# EAGLE design Control v1.0 (EAGLE 9.1.3)
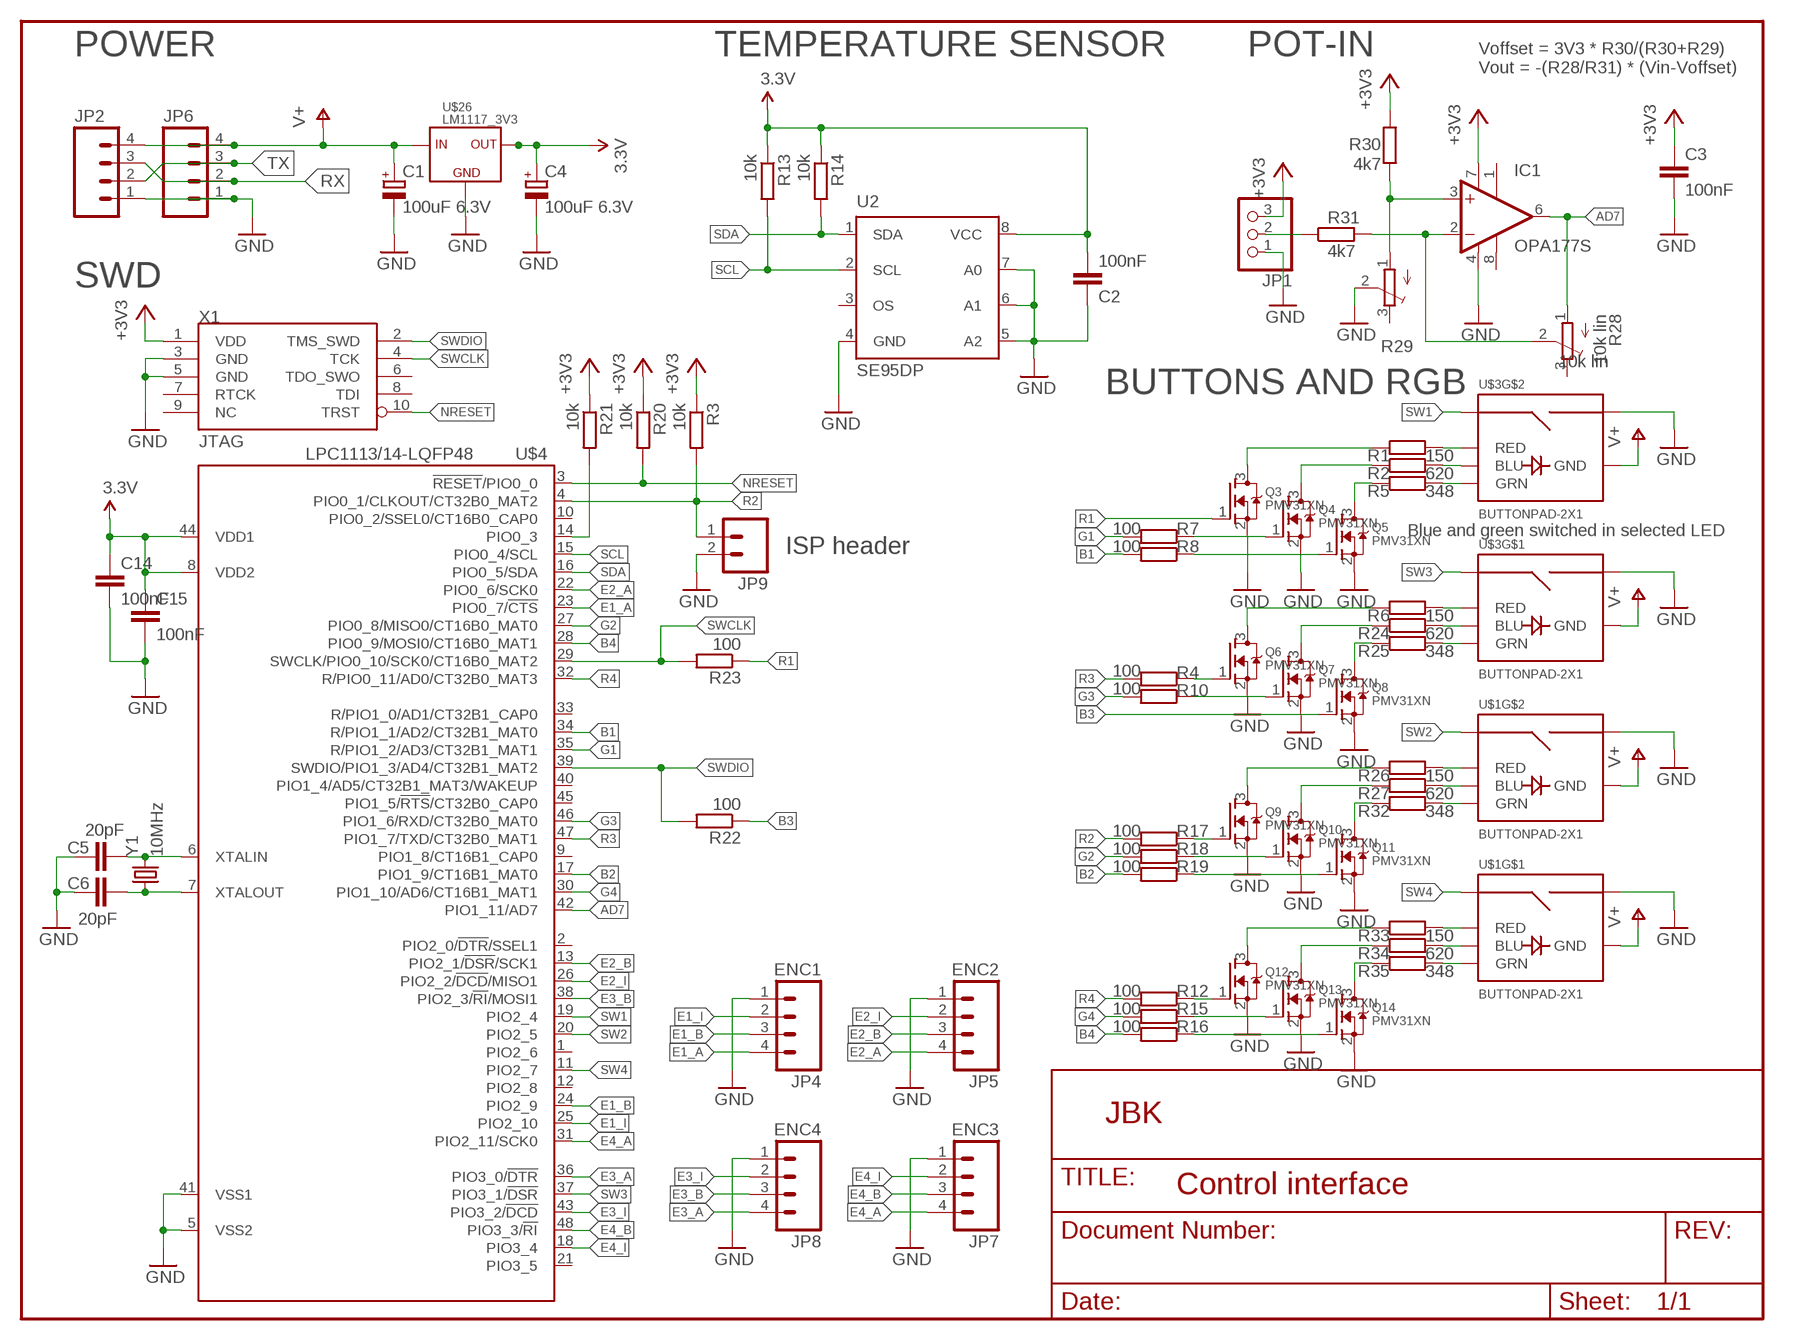
[diagram p0: schematic, sheet 1]

## Parts
C1  100uF 6.3V  CPOL-EUSMCB  [SMC_B]
C2  100nF  CAP0603-CAP  [0603-CAP]
C3  100nF  C-EUC0603  [C0603]
C4  100uF 6.3V  CPOL-EUSMCB  [SMC_B]
C5  20pF  C-EUC0603  [C0603]
C6  20pF  C-EUC0603  [C0603]
C14  100nF  C-EUC0603  [C0603]
C15  100nF  C-EUC0603  [C0603]
IC1  OPA177S  [SO08]
JP1  PINHD-1X3  [1X03]
JP2  M04LOCK  [1X04_LOCK]
JP4  ENC1  M04PTH  [1X04]
JP5  ENC2  M04PTH  [1X04]
JP6  M04LOCK  [1X04_LOCK]
JP7  ENC3  M04PTH  [1X04]
JP8  ENC4  M04PTH  [1X04]
JP9  M02PTH  [1X02]
Q3  PMV31XN  MOSFET-NREFLOW  [SOT23]
Q4  PMV31XN  MOSFET-NREFLOW  [SOT23]
Q5  PMV31XN  MOSFET-NREFLOW  [SOT23]
Q6  PMV31XN  MOSFET-NREFLOW  [SOT23]
Q7  PMV31XN  MOSFET-NREFLOW  [SOT23]
Q8  PMV31XN  MOSFET-NREFLOW  [SOT23]
Q9  PMV31XN  MOSFET-NREFLOW  [SOT23]
Q10  PMV31XN  MOSFET-NREFLOW  [SOT23]
Q11  PMV31XN  MOSFET-NREFLOW  [SOT23]
Q12  PMV31XN  MOSFET-NREFLOW  [SOT23]
Q13  PMV31XN  MOSFET-NREFLOW  [SOT23]
Q14  PMV31XN  MOSFET-NREFLOW  [SOT23]
R1  150  R-EU_R0603  [R0603]
R2  620  R-EU_R0603  [R0603]
R3  10k  R-EU_R0603  [R0603]
R4  100  R-EU_R0603  [R0603]
R5  348  R-EU_R0603  [R0603]
R6  150  R-EU_R0603  [R0603]
R7  100  R-EU_R0603  [R0603]
R8  100  R-EU_R0603  [R0603]
R10  100  R-EU_R0603  [R0603]
R12  100  R-EU_R0603  [R0603]
R13  10k  R-EU_R0603  [R0603]
R14  10k  R-EU_R0603  [R0603]
R15  100  R-EU_R0603  [R0603]
R16  100  R-EU_R0603  [R0603]
R17  100  R-EU_R0603  [R0603]
R18  100  R-EU_R0603  [R0603]
R19  100  R-EU_R0603  [R0603]
R20  10k  R-EU_R0603  [R0603]
R21  10k  R-EU_R0603  [R0603]
R22  100  R-EU_R0603  [R0603]
R23  100  R-EU_R0603  [R0603]
R24  620  R-EU_R0603  [R0603]
R25  348  R-EU_R0603  [R0603]
R26  150  R-EU_R0603  [R0603]
R27  620  R-EU_R0603  [R0603]
R28  10k lin  TRIM_EU-3223W  [3223W]
R29  10k lin  TRIM_EU-3223W  [3223W]
R30  4k7  R-EU_R0603  [R0603]
R31  4k7  R-EU_R0603  [R0603]
R32  348  R-EU_R0603  [R0603]
R33  150  R-EU_R0603  [R0603]
R34  620  R-EU_R0603  [R0603]
R35  348  R-EU_R0603  [R0603]
U2  SE95DP  [TSSOP8-SOT505-1]
U$1  BUTTONPAD-2X1  [BUTTONPAD-2X1]
U$3  BUTTONPAD-2X1  [BUTTONPAD-2X1]
U$4  LPC1113/14-LQFP48  [LQFP48]
U$26  LM1117_3V3  [SOT223]
X1  JTAG_10WAY  [JTAG_10WAY_1.27MM]
Y1  10MHz  CRYSTALSMD  [HC49UP]

## Nets
+3V3: C2.2 C3.1 C4.+ C14.1 C15.1 IC1.7(V+) JP1.3 R3.1 R13.1 R14.1 R20.1 R21.1 R30.2 U2.8(VCC) U$4.8(VDD2) U$4.44(VDD1) U$26.2(OUT) U$26.4(OUT) X1.1(VDD) ; supply symbol labelled 3.3V
AD7: IC1.6(OUT) R28.1(A) U$4.42(PIO1_11/AD7)
B1: R8.2 U$4.34(R/PIO1_1/AD2/CT32B1_MAT0)
B2: R19.2 U$4.17(PIO1_9/CT16B1_MAT0)
B3: Q8.1(G) R22.1
B4: R16.2 U$4.28(PIO0_9/MOSI0/CT16B0_MAT1)
E1_A: JP4.4 U$4.23(PIO0_7/!CTS!)
E1_B: JP4.3 U$4.24(PIO2_9)
E1_I: JP4.2 U$4.25(PIO2_10)
E2_A: JP5.4 U$4.22(PIO0_6/SCK0)
E2_B: JP5.3 U$4.13(PIO2_1/!DSR!/SCK1)
E2_I: JP5.2 U$4.26(PIO2_2/!DCD!/MISO1)
E3_A: JP8.4 U$4.36(PIO3_0/!DTR!)
E3_B: JP8.3 U$4.38(PIO2_3/!RI!/MOSI1)
E3_I: JP8.2 U$4.43(PIO3_2/!DCD!)
E4_A: JP7.4 U$4.31(PIO2_11/SCK0)
E4_B: JP7.3 U$4.48(PIO3_3/!RI!)
E4_I: JP7.2 U$4.18(PIO3_4)
G1: R7.2 U$4.35(R/PIO1_2/AD3/CT32B1_MAT1)
G2: R18.2 U$4.27(PIO0_8/MISO0/CT16B0_MAT0)
G3: R10.2 U$4.46(PIO1_6/RXD/CT32B0_MAT0)
G4: R15.2 U$4.30(PIO1_10/AD6/CT16B1_MAT1)
GND: C1.- C2.1 C3.2 C4.- C5.1 C6.1 C14.2 C15.2 IC1.4(V-) JP1.1 JP2.1 JP4.1 JP5.1 JP6.1 JP7.1 JP8.1 JP9.2 Q3.2(S) Q4.2(S) Q5.2(S) Q6.2(S) Q7.2(S) Q8.2(S) Q9.2(S) Q10.2(S) Q11.2(S) Q12.2(S) Q13.2(S) Q14.2(S) R29.2(S) U2.4(GND) U2.5(A2) U2.6(A1) U2.7(A0) U$1.SW0-1(SIG2) U$1.SW1-1(SIG2) U$3.SW0-1(SIG2) U$3.SW1-1(SIG2) U$4.5(VSS2) U$4.41(VSS1) U$26.1 X1.3(GND) X1.5(GND)
N$2: Q6.3(D) R6.1
N$3: Q7.3(D) R24.1
N$4: Q8.3(D) R25.1
N$5: R21.2 U$4.14(PIO0_3)
N$7: Q6.1(G) R4.1
N$8: Q4.3(D) R2.1
N$9: Q5.3(D) R5.1
N$11: IC1.2(-IN) R28.2(S) R31.2
N$12: IC1.3(+IN) R29.1(A) R30.1
N$13: Q7.1(G) R10.1
N$15: Q9.1(G) R17.1
N$16: Q9.3(D) R26.1
N$17: Q10.3(D) R27.1
N$18: Q3.3(D) R1.1
N$19: Q11.3(D) R32.1
N$20: Q4.1(G) R7.1
N$21: Q5.1(G) R8.1
N$22: Q10.1(G) R18.1
N$23: Q11.1(G) R19.1
N$24: JP1.2 R31.1
N$25: C5.2 U$4.6(XTALIN) Y1.2
N$26: C6.2 U$4.7(XTALOUT) Y1.1
N$27: Q12.1(G) R12.1
N$28: Q12.3(D) R33.1
N$29: Q13.3(D) R34.1
N$30: Q14.3(D) R35.1
N$31: Q13.1(G) R15.1
N$32: Q14.1(G) R16.1
N$33: R1.2 U$3.RED1(RED)
N$34: R2.2 U$3.BLU1(BLU)
N$35: R5.2 U$3.GRN1(GRN)
N$36: R6.2 U$3.RED0(RED)
N$37: R24.2 U$3.BLU0(BLU)
N$38: R25.2 U$3.GRN0(GRN)
N$39: R26.2 U$1.RED1(RED)
N$40: R27.2 U$1.BLU1(BLU)
N$41: R32.2 U$1.GRN1(GRN)
N$42: R33.2 U$1.RED0(RED)
N$43: R34.2 U$1.BLU0(BLU)
N$44: R35.2 U$1.GRN0(GRN)
NRESET: R20.2 U$4.3(!RESET!/PIO0_0) X1.10(TRST)
R1: Q3.1(G) R23.1
R2: JP9.1 R3.2 R17.2 U$4.4(PIO0_1/CLKOUT/CT32B0_MAT2)
R3: R4.2 U$4.47(PIO1_7/TXD/CT32B0_MAT1)
R4: R12.2 U$4.32(R/PIO0_11/AD0/CT32B0_MAT3)
RX: JP2.3 JP6.2
SCL: R13.2 U2.2(SCL) U$4.15(PIO0_4/SCL)
SDA: R14.2 U2.1(SDA) U$4.16(PIO0_5/SDA)
SW1: U$3.SW1-0(SIG1) U$4.19(PIO2_4)
SW2: U$1.SW1-0(SIG1) U$4.20(PIO2_5)
SW3: U$3.SW0-0(SIG1) U$4.37(PIO3_1/!DSR!)
SW4: U$1.SW0-0(SIG1) U$4.11(PIO2_7)
SWCLK: R23.2 U$4.29(SWCLK/PIO0_10/SCK0/CT16B0_MAT2) X1.4(TCK)
SWDIO: R22.2 U$4.39(SWDIO/PIO1_3/AD4/CT32B1_MAT2) X1.2(TMS_SWD)
TX: JP2.2 JP6.3
V+: C1.+ JP2.4 JP6.4 U$1.GND0(GND) U$1.GND1(GND) U$3.GND0(GND) U$3.GND1(GND) U$26.3
Unconnected: IC1.1(TRIM1) IC1.8(TRIM2) R28.3(E) R29.3(E) U2.3(OS) U$4.1(PIO2_6) U$4.2(PIO2_0/!DTR!/SSEL1) U$4.9(PIO1_8/CT16B1_CAP0) U$4.10(PIO0_2/SSEL0/CT16B0_CAP0) U$4.12(PIO2_8) U$4.21(PIO3_5) U$4.33(R/PIO1_0/AD1/CT32B1_CAP0) U$4.40(PIO1_4/AD5/CT32B1_MAT3/WAKEUP) U$4.45(PIO1_5/!RTS!/CT32B0_CAP0) X1.6(TDO_SWO) X1.7(RTCK) X1.8(TDI) X1.9(NC)

## Notes on the sheet
- POWER | TEMPERATURE SENSOR | POT-IN
- Voffset = 3V3 * R30/(R30+R29)
  Vout = -(R28/R31) * (Vin-Voffset)
- SWD
- BUTTONS AND RGB
- Blue and green switched in selected LED
- ISP header
- JBK
- Control interface

## Library data of the parts
C1 C4 = rcl:CPOL-EU: POLARIZED CAPACITOR, European symbol
C2 = SparkFun:CAP: Capacitor Standard 0603 ceramic capacitor, and 0.1" leaded capacitor.
C3 C5 C6 C14 C15 = rcl:C-EU: CAPACITOR, European symbol
IC1 = burr-brown:OPA177: Precision Operational Amplifier; MF: TEXAS INSTRUMENTS; MPN: OPA177GS; OC_FARNELL: 1212431; OC_NEWARK: 35C0218
JP1 = adafruit:PINHD-1X3: PIN HEADER
JP2 JP4-JP8 = SparkFun-Connectors:M04: Header 4 Standard 4-pin 0.1" header. Use with straight break away headers (SKU : PRT-00116), right angle break away headers (PRT-00553), swiss pins (PRT-00743), machine pins (PRT-00117), and female headers (PRT-00115). Molex polarized connector foot print use with SKU : PRT-08231 with associated crimp pins and housings. 1MM SMD Version SKU: PRT-10208
JP9 = SparkFun-Connectors:M02: Standard 2-pin 0.1" header. Use with - straight break away headers ( PRT-00116) - right angle break away headers (PRT-00553) - swiss pins (PRT-00743) - machine pins (PRT-00117) - female headers (PRT-00115) Molex polarized connector foot print use with: PRT-08233 with associated crimp pins and housings. 2.54_SCREWTERM for use with PRT-10571. 3.5mm Screw Terminal footprints for PRT-08084 5mm Screw Terminal footprints for use with PRT-08432
Q3-Q14 = adafruit:MOSFET-N: N-Channel Mosfet 2N7002E - 60V 260mA SOT23 [Digikey: 2N7002ET1GOSTR-ND] - REEL BSH103 - 30V 850mA SOT23 [Digikey: 568-5013-1-ND]
R1 R2 R4-R8 R10 R12 R15-R19 R22-R27 R32-R35 = rcl:R-EU_: RESISTOR, European symbol
R3 R13 R14 R20 R21 R30 R31 = NXP:R-EU_: RESISTOR, European symbol
R28 R29 = pot:TRIM_EU-: POTENTIOMETER
U2 = Chun_S_Chu:SE95DP
U$1 U$3 = SparkFun-Electromechanical:BUTTONPAD-2X1
U$4 = lpc1100v2:LPC1113/14-LQFP48: NXP Semiconductors LPC11xx microcontrollers <http://ics.nxp.com/products/lpc1000/lpc11xx/> ARM 32-bit Cortex-M0 Microcontroller with MPU CPU clock up to 50MHz Up to 32KByte on-chip Flash ROM with In-System Programming (ISP) and In-Application Programming (IAP) via On-Chip Bootloader Up to 8KByte SRAM Nested Vectored Interrupt Controller Up to 2 SPI controllers UART with full Modem Interface and RS485 Support Fast Mode I2C-Bus 4 Timers with 4 capture channels and 13 output channels Watchdog (WDT) Sytem tick timer 10-bit ADC with 8 channels Power Management Unit (PMU) Brownout detection 12MHz internal RC oscillator Serial Wire Debug/Trace port
U$26 = NXP:LM1117
X1 = Q_copter:JTAG_10WAY
Y1 = SparkFun-FreqCtrl:CRYSTAL: Various standard crystals. Proven footprints. Spark Fun Electronics SKU : COM-00534

## Net classes
1 Power: width 0.305 mm
2 LEDPower: width 0.305 mm
3 ButtonSignal: width 0.254 mm

## Board
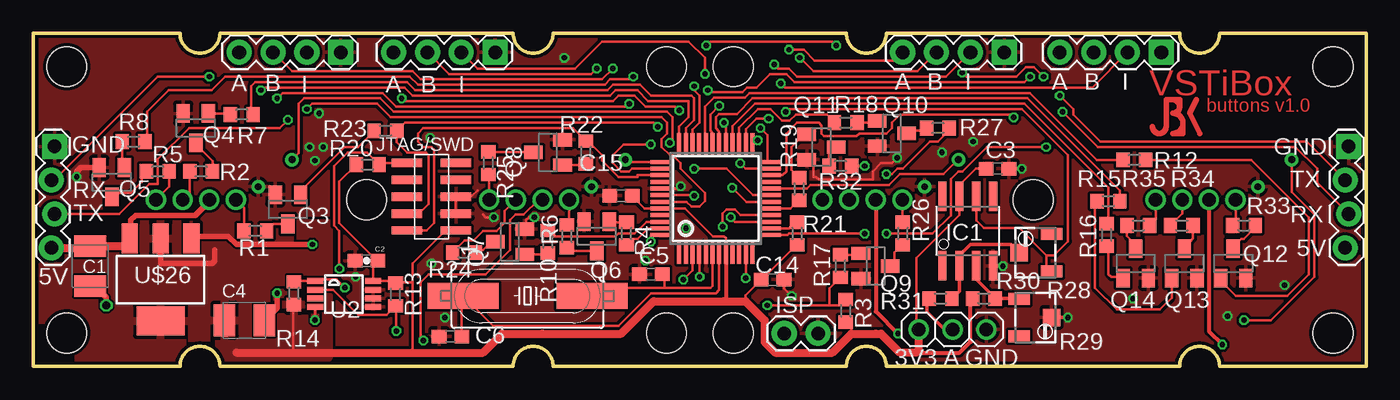
[diagram p1: board, top side]
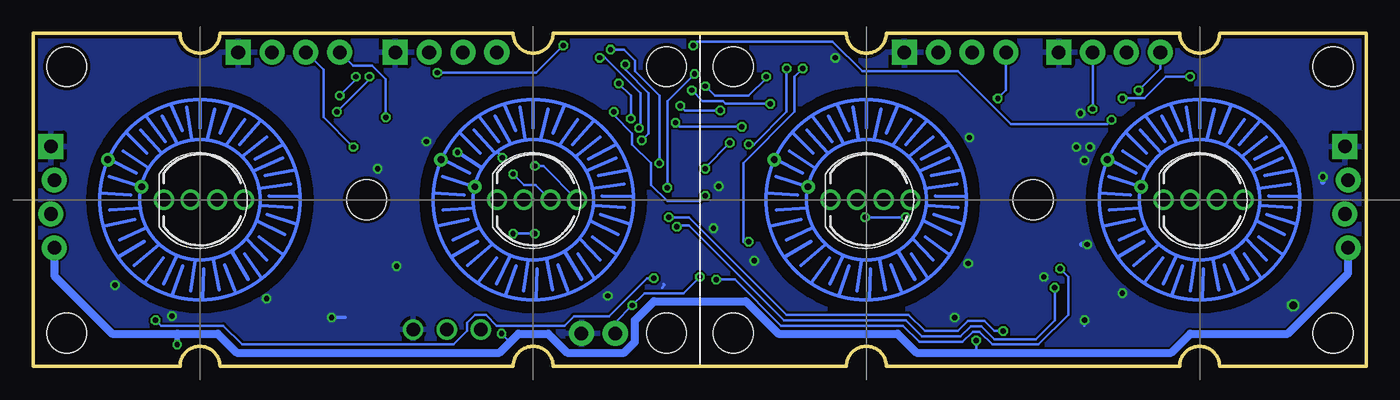
[diagram p2: board, bottom side, seen from below]

Size 100 x 25 mm. Coordinates in mm from the lower left corner, seen from the top.
Outline: 0,0 11,0 arc-90 12.5,1.5 arc-90 14,0 36,0 arc-90 37.5,1.5 arc-90 39,0 61,0 arc-90 62.5,1.5 arc-90 64,0 86,0 arc-90 87.5,1.5 arc-90 89,0 100,0 100,25 89,25 arc-90 87.5,23.5 arc-90 86,25 64,25 arc-90 62.5,23.5 arc-90 61,25 39,25 arc-90 37.5,23.5 arc-90 36,25 14,25 arc-90 12.5,23.5 arc-90 11,25 0,25 0,0
Copper layers (1*16): Top 0.035mm / dielectric 1.5mm / Bottom 0.035mm
Design rules "ITEADstudio_DRC *": minimum track width 6mil, minimum drill 12mil, track to track 6mil, track to pad 6mil, pad to pad 6mil, via to via 6mil, smd to smd 0mil, copper to edge 10mil, drill to drill 10mil, minimum pad ring 10mil, minimum via ring 6mil, stop-mask expansion 2mil, vias tented up to drill 100mil, thermal gap 10mil
bRestrict: area 4.2,4.2 to 20.8,20.8; area 29.2,4.2 to 45.8,20.8; area 54.2,4.2 to 70.8,20.8; area 79.2,4.2 to 95.8,20.8

### Footprints (pad centres in the part's own frame; a part is rotated, then mirrored left to right if it is on the bottom)
SMC_B = smd 1.6 x 2.4: + -1.5,0; - 1.5,0
0603-CAP = smd 1.1 x 1: 1 -0.85,0; 2 0.85,0
C0603 = smd 1.1 x 1: 1 -0.85,0; 2 0.85,0
SO08 = smd 0.61 x 2.21: 1 -1.905,-2.616; 2 -0.635,-2.616; 3 0.635,-2.616; 4 1.905,-2.616; 5 1.905,2.616; 6 0.635,2.616; 7 -0.635,2.616; 8 -1.905,2.616
1X03 = drill 1.016: 1 -2.54,0; 2 0,0; 3 2.54,0
1X04_LOCK = drill 1.016 pad 1.88 square: 1 0,0.127 | drill 1.016 pad 1.88: 2 2.54,-0.127; 3 5.08,0.127; 4 7.62,-0.127
1X04 = drill 1.016 pad 1.88 square: 1 0,0 | drill 1.016 pad 1.88: 2 2.54,0; 3 5.08,0; 4 7.62,0
1X02 = drill 1.016 pad 1.88: 1 0,0; 2 2.54,0
SOT23 = smd 1 x 1.4: 1 -0.95,-1.1; 2 0.95,-1.1; 3 0,1.1
R0603 = smd 1 x 1.1: 1 -0.85,0; 2 0.85,0
3223W = smd 0.9 x 1.6: 1 -1.4,-1.215; 3 1.4,-1.215 | smd 1.3 x 1.3: 2 0,1.215
TSSOP8-SOT505-1 = smd 0.45 x 1.2: 1 -0.975,-2.175; 2 -0.325,-2.175; 3 0.325,-2.175; 4 0.975,-2.175; 5 0.975,2.175; 6 0.325,2.175; 7 -0.325,2.175; 8 -0.975,2.175
BUTTONPAD-2X1 = drill 1: BLU0 13.8,12.5; BLU1 38.8,12.5; GND0 11.8,12.5; GND1 36.8,12.5; GRN0 15.8,12.5; GRN1 40.8,12.5; RED0 9.8,12.5; RED1 34.8,12.5 | drill 0.508: SW0-0 5.588,15.513; SW0-1 8.128,13.481; SW1-0 30.588,15.513; SW1-1 33.128,13.481 | hole 3: 25,12.5; 2.5,2.5; 47.5,2.5; 2.5,22.5; 47.5,22.5
LQFP48 = smd 0.3 x 1.6: 1 -2.75,-4.1; 2 -2.25,-4.1; 3 -1.75,-4.1; 4 -1.25,-4.1; 5 -0.75,-4.1; 6 -0.25,-4.1; 7 0.25,-4.1; 8 0.75,-4.1; 9 1.25,-4.1; 10 1.75,-4.1; 11 2.25,-4.1; 12 2.75,-4.1; 25 2.75,4.1; 26 2.25,4.1; 27 1.75,4.1; 28 1.25,4.1; 29 0.75,4.1; 30 0.25,4.1; 31 -0.25,4.1; 32 -0.75,4.1; 33 -1.25,4.1; 34 -1.75,4.1; 35 -2.25,4.1; 36 -2.75,4.1 | smd 1.6 x 0.3: 13 4.1,-2.75; 14 4.1,-2.25; 15 4.1,-1.75; 16 4.1,-1.25; 17 4.1,-0.75; 18 4.1,-0.25; 19 4.1,0.25; 20 4.1,0.75; 21 4.1,1.25; 22 4.1,1.75; 23 4.1,2.25; 24 4.1,2.75; 37 -4.1,2.75; 38 -4.1,2.25; 39 -4.1,1.75; 40 -4.1,1.25; 41 -4.1,0.75; 42 -4.1,0.25; 43 -4.1,-0.25; 44 -4.1,-0.75; 45 -4.1,-1.25; 46 -4.1,-1.75; 47 -4.1,-2.25; 48 -4.1,-2.75
SOT223 = smd 1.219 x 2.235: 1 -2.311,-3.099; 2 0,-3.099; 3 2.311,-3.099 | smd 3.6 x 2.2: 4 0,3.099
JTAG_10WAY_1.27MM = smd 0.635 x 2.286: 1 0,-0.572; 2 0,3.111; 3 1.27,-0.572; 4 1.27,3.111; 5 2.54,-0.572; 6 2.54,3.111; 7 3.81,-0.572; 8 3.81,3.111; 9 5.08,-0.572; 10 5.08,3.111
HC49UP = smd 5.334 x 1.93: 1 -4.826,0; 2 4.826,0

### Placement (x,y rotation side)
C1  4.27,7.52 270 top
C2  24.99,7.92 0 top
C3  72.34,14.83 0 top
C4  15.85,3.45 0 top
C5  46.33,6.91 0 top
C6  31.29,2.24 0 top
C14  55.47,6.5 0 top
C15  44.09,12.8 180 top
IC1  70.1,10.16 0 top
JP1  68.96,2.76 180 top
JP2  98.55,16.51 270 top
JP4  72.85,23.57 180 top
JP5  84.63,23.57 180 top
JP6  1.47,16.51 270 top
JP7  34.65,23.57 180 top
JP8  23.06,23.57 180 top
JP9  56.34,2.46 0 top
Q3  19.1,11.79 180 top
Q4  12.19,17.88 180 top
Q5  5.89,13.82 180 top
Q6  42.27,9.75 180 top
Q7  35.76,9.35 90 top
Q8  38.61,16.05 90 top
Q9  63.2,7.52 270 top
Q10  64.41,17.48 270 top
Q11  59.13,16.46 270 top
Q12  90.02,7.72 0 top
Q13  86.36,7.72 0 top
Q14  82.7,7.72 0 top
R1  16.66,10.16 180 top
R2  12.6,14.63 180 top
R3  60.96,4.17 90 top
R4  44.5,9.96 270 top
R5  9.35,14.63 0 top
R6  40.03,9.75 90 top
R7  15.65,18.9 0 top
R8  7.52,16.87 0 top
R10  38.61,9.35 90 top
R12  82.6,15.49 180 top
R13  27.18,5.38 270 top
R14  19.56,5.49 90 top
R15  80.67,12.4 0 top
R16  80.52,9.86 90 top
R17  60.55,7.52 270 top
R18  60.96,18.29 180 top
R19  57.45,13.31 270 top
R20  25.1,15.14 0 top
R21  57.3,9.96 90 top
R22  41.46,16.05 90 top
R23  26.42,17.68 0 top
R24  32.31,8.53 180 top
R25  34.14,15.24 270 top
R26  65.23,9.96 90 top
R27  67.87,17.88 0 top
R28  75.18,8.53 90 top
R29  75.18,3.66 270 top
R30  71.32,5.08 180 top
R31  68.07,5.08 0 top
R32  60.55,15.04 0 top
R33  90.83,10.57 180 top
R34  86.16,10.57 180 top
R35  82.91,10.57 0 top
U2  23.31,5.42 270 top
U$1  100,0 0 bottom
U$3  50,0 0 bottom
U$4  51.21,12.6 0 top
U$9  [JBK_LOGO_SMALL_COPPER]  83.72,17.48 0 top
U$26  9.55,6.5 180 top
X1  31.14,10.19 90 top
Y1  37.08,5.28 0 top

### Tracks (layer width: path | path; a pad name or v marks a point on that pad's centre or on a via)
+3V3
  Top 0.203: U$4.8 51.96,9.61 51.82,9.75 51,9.75 48.91,11.85 U$4.44 45.86,11.85 44.94,12.76 C15.1 45.35,12.8 | R3.1 61.37,3.69 61.37,2.44 | 38.2,2.44 | 28.45,6.3 28.45,7.72 30.92,10.19 X1.1 | 28.45,6.3 28.45,1.02 | 28.45,6.3 27.24,6.3 R13.1 27.01,6.4 U2.8 25.48,7.56 C2.2 25.81,7.92 22.96,10.77 22.96,13.86 R20.1 | R14.1 19.51,4.59 19.51,1.02 | C3.1 70.71,14.83 69.47,13.59 IC1.7 69.47,11.35 66.24,8.13 66.24,2.76 JP1.3 | 53.44,4.88 53.44,5.32 C14.1 54.66,6.5 56.9,8.74 57.14,8.74 R21.1
  Top 0.305: U$4.8 51.96,5.02 51.82,4.88 | 66.24,1.02 69.49,1.02 70.31,1.83 70.31,4.91 R30.2
  Top 0.406: 63.2,2.44 | U$26.2 9.55,7.72 13.41,7.72 13.61,7.92 13.61,8.74
  Top 0.61: 15.24,1.02 19.51,1.02 28.45,1.02 33.73,1.02 35.15,2.44 38.2,2.44 44.09,2.44 46.53,4.88 51.82,4.88 53.44,4.88 54.86,3.45 54.86,1.83 55.68,1.02 59.94,1.02 61.37,2.44 63.2,2.44 63.6,2.44 65.02,1.02 66.24,1.02 66.42,1.2 JP1.3
  pour Top (rank 2): 2.64,10.77 22.15,10.77 22.15,0.61 0.61,0.61 0.61,7.52 2.64,7.52
AD7  (via drill 0.4)
  Top 0.203: U$4.42 49.53,12.85 arc-90 v49.58,12.8 | v56.44,19.1 56.64,19.3 74.17,19.3 77.62,15.85 77.62,9.37 76.58,8.33 76,8.33 | IC1.6 70.74,10.95 71.32,10.36 73.97,10.36 76,8.33 | 76,8.33 76,7.54 R28.1
  Bottom 0.203: v49.58,12.8 49.99,12.39 52.43,12.39 53.65,13.61 53.65,15.24 55.07,16.66 55.07,17.48 56.44,18.85 v56.44,19.1
B1  (via drill 0.4)
  Top 0.203: R8.2 8.53,16.87 8.53,19.1 10.16,20.73 13.37,20.73 14.39,21.74 28.25,21.74 28.85,21.13 42.88,21.13 43.28,21.54 44.81,21.54 v45.01,21.74 | v49.58,21.03 49.58,20.73 49.99,20.32 49.99,18.29 49.46,17.76 U$4.34
  Bottom 0.203: v45.01,21.74 45.01,21.64 46.33,20.32 48.87,20.32 v49.58,21.03
B2
  Top 0.203: U$4.17 56.8,11.85 57.41,12.46 R19.2
B3
  Top 0.203: Q8.1 41.36,15.1 R22.1
B4
  Top 0.203: U$4.28 52.46,18.01 54.15,19.71 74.37,19.71 80.67,13.41 80.67,11.18 80.52,11.02 R16.2
E1_A  (via drill 0.4)
  Top 0.203: U$4.23 53.43,14.85 v53.03,15.24 | v56.69,23.77 57.81,23.77 58.62,22.96 64.62,22.96 JP4.4
  Bottom 0.203: v53.03,15.24 53.03,20.32 54.86,22.15 54.86,22.96 55.68,23.77 v56.69,23.77
E1_B  (via drill 0.4)
  Top 0.203: v57.51,23.16 58.52,22.15 66.34,22.15 JP4.3 | v54.56,17.88 55.07,17.37 55.07,15.35 U$4.24
  Bottom 0.203: v54.56,17.88 54.46,17.98 54.46,20.52 57.1,23.16 v57.51,23.16
E1_I  (via drill 0.4)
  Top 0.203: v55.58,22.66 55.88,22.35 56.69,22.35 57.3,21.74 68.48,21.74 JP4.2
  Top 0.254: U$4.25 53.96,16.97 v54.36,16.97
  Bottom 0.203: v54.36,16.97 53.85,17.48 53.85,20.52 55.58,22.25 v55.58,22.66
E2_A  (via drill 0.4)
  Top 0.203: v73.56,18.69 73.36,18.9 65.02,18.9 64.41,18.29 64.41,17.88 64.01,17.48 61.98,17.48 61.77,17.27 59.33,17.27 59.13,17.48 59.13,18.09 58.93,18.29 57.3,18.29 56.49,17.48 56.49,14.63 56.21,14.35 U$4.22
  Bottom 0.203: v73.56,18.69 73.56,21.54 74.57,22.55 76,22.55 JP5.4
E2_B  (via drill 0.4)
  Top 0.203: v76,16.46 71.53,16.46 69.7,14.63 69.39,14.63 68.83,14.07 68.83,11.33 67.46,9.96 v64.01,9.96 | v62.38,9.96 56.69,9.96 56.58,9.85 U$4.13
  Bottom 0.203: v76,16.46 78.23,18.69 78.23,22.25 JP5.3 | v62.38,9.96 v64.01,9.96
E2_I  (via drill 0.4)
  Top 0.203: v56.08,21.23 56.39,20.93 79.45,20.93 JP5.2 | U$4.26 53.46,17.8 54.25,18.59 v55.17,18.59
  Bottom 0.203: v55.17,18.59 55.17,20.32 v56.08,21.23
E3_A  (via drill 0.4)
  Top 0.203: v17.07,20.73 17.27,20.93 27.84,20.93 28.45,20.32 43.28,20.32 43.69,20.73 45.31,20.73 46.13,19.91 49.17,19.91 49.17,18.69 48.46,17.98 U$4.36
  Bottom 0.203: v17.07,20.73 15.44,22.35 JP8.4
E3_B  (via drill 0.4)
  Top 0.203: U$4.38 44.92,14.85 44.7,14.63 44.09,14.63 43.48,15.24 43.48,15.85 44.3,16.66 v46.33,16.66 | v43.48,22.35 42.67,21.54 29.06,21.54 28.45,22.15 19.41,22.15 JP8.3
  Bottom 0.203: v46.33,16.66 45.92,16.66 43.48,19.1 v43.48,22.35
E3_I  (via drill 0.4)
  Top 0.203: v20.52,19.3 20.93,19.71 25.81,19.71 26.82,18.69 47.14,18.69 47.55,18.29 47.55,17.48 47.14,17.07 47.14,16.46 47.75,15.85 47.95,15.85 48.56,15.24 48.56,14.83 50.39,13.01 50.39,12.39 49.99,11.99 49.38,11.99 49.02,12.35 U$4.43
  Bottom 0.203: JP8.2 v20.52,19.3
E4_A  (via drill 0.4)
  Top 0.203: U$4.31 50.96,17.52 50.8,17.68 50.8,18.9 v51.46,19.56 | v48.46,19.2 48.16,19.51 45.92,19.51 45.11,20.32 43.89,20.32 43.48,19.91 27.84,19.91 v27.64,20.12
  Bottom 0.203: v27.64,20.12 27.03,20.73 JP7.4 | v48.46,19.2 51.1,19.2 v51.46,19.56
E4_B  (via drill 0.4)
  Top 0.203: U$4.48 46.33,9.85 v46.33,9.35 | v42.27,22.35 41.86,21.95 31.19,21.95 JP7.3
  Bottom 0.203: v46.33,9.35 46.74,9.35 46.74,15.24 42.88,19.1 42.88,21.74 v42.27,22.35
E4_I  (via drill 0.4)
  Top 0.203: v50.39,21.95 50.39,23.16 49.17,24.38 42.67,24.38 40.64,22.35 33.33,22.35 JP7.2 | U$4.18 53.49,12.35 v52.43,13.41
  Bottom 0.203: v50.39,21.95 52.43,19.91 v52.43,13.41
G1
  Top 0.203: U$4.35 48.97,16.71 48.97,17.88 49.58,18.49 49.58,20.12 49.38,20.32 46.33,20.32 45.52,21.13 43.48,21.13 43.08,20.73 28.65,20.73 28.04,21.34 16.66,21.34 16.36,21.03 16.36,19.04 R7.2
G2
  Top 0.203: U$4.27 52.96,17.9 54.36,19.3 55.32,19.3 56.19,18.44 56.74,18.44 57.2,18.9 59.54,18.9 60.11,18.32 R18.2
G3
  Top 0.203: U$4.46 46,10.85 45.11,9.96 43.89,9.96 43.69,9.75 39.05,9.75 R10.2
G4
  Top 0.203: U$4.30 51.46,17.63 51.21,17.88 51.21,18.69 51.46,18.95 52.78,18.95 53.95,20.12 74.59,20.12 81.52,13.18 R15.2
GND  (via drill 0.4, 0.6)
  Top 0.203: U2.4 v21.13,3.46 v21.13,3.45 | U$4.41 48.4,13.35 v48.56,13.51 | X1.3 31.7,11.48 31.7,12.8 32.92,12.8 33.33,13.21 | v45.92,7.92 46.53,7.92 | C14.2 56.32,5.86 v56.9,5.28 | U$3.SW0-1 41.72,13.33 | 64.82,15.85 v64.82,15.65 64.41,15.24 63.6,15.24 62.99,14.63 62.99,14.02 58.93,14.02 58.73,14.22 58.52,14.22 58.52,15.24 58.25,15.51 Q11.2 | 36.92,10.3 Q7.2 36.98,10.42 36.98,10.97 37.19,11.18 v37.59,11.18 | v34.54,11.18 33.93,11.18 33.73,11.38
  Top 0.254: R29.2 v77.62,3.66 | IC1.4 72.03,7.52 v72.75,7.52 | C3.2 v74.17,14.83
  Top 0.406: C1.- 4.8,5.49 5.18,5.49 5.49,5.18 v5.49,4.57 | C4.- 18.29,4.39 v18.29,5.49 | U$26.1 12.01,9.75 14.63,9.75 15.24,9.14 v20.93,9.14 | Q5.2 3.54,14.92 3.25,14.63 v3.25,14.22
  Bottom 0.203: v21.13,3.45 21.13,3.05 | 52.83,5.89 52.63,6.1 52.73,6.2 | v48.56,13.51 48.77,13.72 | 66.87,13.6 U$1.SW1-1 arc14 66.45,14.68 66.34,14.88 | v68.17,16.05 66.34,14.88 | v64.82,15.65 65.18,16.1 65.43,15.9 arc-19 66.34,14.88 | v37.59,11.18 v34.54,11.18
  Bottom 0.254: v77.62,3.66 76.61,3.66 | v72.75,7.52 72.95,7.52
  Bottom 0.406: v3.25,14.22 3.25,13.82 | v20.93,9.14 21.34,9.14
  other vias: 24.18,6.71 29.87,7.72 29.77,17.17 21.44,19 39.83,23.16 89.61,3.76 21.13,15.44 21.74,16.46 20.73,16.46 30.89,3.66 82.5,5.08 93.88,6.1 70.51,16.87 48.97,10.36
  pour Bottom: 0,25 100,25 100,0 0,0
  pour Bottom (isolate 0.203): 0,25 100,25 100,0 0,0
  pour Top (isolate 0.203, rank 3): 0,0 99.97,0 99.97,16.87 80.77,16.87 80.77,24.99 0,24.99
N$2
  Top 0.203: R6.1 40.28,8.65 Q6.3
N$3
  Top 0.203: R24.1 33.36,8.74 33.73,8.74 34.34,9.35 Q7.3
N$4
  Top 0.203: R25.1 37.47,16.09 Q8.3
N$5
  Top 0.203: U$4.14 56.68,10.35 56.9,10.57 57.06,10.57 R21.2
N$7
  Top 0.203: R4.1 43.26,10.81 Q6.1
N$8
  Top 0.203: Q4.3 12.6,16.38 12.6,16.26 13.45,15.41 R2.1
N$9
  Top 0.203: Q5.3 5.98,13.01 7.32,13.01 8.13,13.82 8.13,14.22 8.5,14.59 R5.1
N$11
  Top 0.254: R31.2 69.47,5.63 IC1.2 69.47,8.31 70.31,9.14 73.36,9.14 R28.2
N$12
  Top 0.254: IC1.3 70.74,6.51 R30.1 74.15,5.08 R29.1
N$13
  Top 0.203: R10.1 38.51,8.4 Q7.1
N$15
  Top 0.203: R17.1 61.99,8.37 Q9.1
N$16
  Top 0.203: 64.45,7.52 Q9.3 64.62,7.84 64.62,8.53 65.19,9.11 R26.1
N$17
  Top 0.203: Q10.3 65.72,17.68 66.82,17.68 R27.1
N$18
  Top 0.203: R1.1 18.04,10.69 Q3.3
N$19
  Top 0.203: R32.1 59.7,16.22 59.74,16.26 60.03,16.26 Q11.3
N$20
  Top 0.203: Q4.1 14.71,18.98 R7.1
N$21
  Top 0.203: R8.1 6.67,14.95 Q5.1
N$22
  Top 0.203: R18.1 62.84,18.29 Q10.1
N$23
  Top 0.203: Q11.1 57.85,17.41 56.9,16.46 56.9,14.72 R19.1
N$24
  Top 0.254: R31.1 67.06,4.91 67.06,4.06 68.36,2.76 JP1.2
N$25
  Top 0.203: U$4.6 50.96,6.05 50.8,5.89 47.35,5.89 | 47.35,5.89 43.28,5.89 43.08,5.69 Y1.2 | C5.2 47.35,6.74 47.35,5.89
N$26
  Top 0.203: U$4.7 51.46,5.74 51.21,5.49 46.33,5.49 43.89,3.05 34.49,3.05 Y1.1 | 32.05,5.07 Y1.1 | C6.2 32.14,5.17 Y1.1
N$27
  Top 0.203: R12.1 91.39,15.49 95.71,11.18 95.71,6.91 94.08,5.28 90.22,5.28 89.41,6.1 89.41,6.28 Q12.1
N$28
  Top 0.203: R33.1 91.68,10.4 90.83,9.55 90.63,9.55 90.42,9.35 90.42,9.23 Q12.3
N$29
  Top 0.203: R34.1 87.01,9.59 86.77,9.35 86.77,9.23 Q13.3
N$30
  Top 0.203: R35.1 82.06,9.79 82.5,9.35 82.5,9.03 Q14.3
N$31
  Top 0.203: R15.1 79.65,12.23 79.65,5.89 81.28,4.27 84.53,4.27 85.41,5.15 Q13.1
N$32
  Top 0.203: R16.1 arc-90 80.67,8.85 80.67,6.91 80.87,6.71 81.67,6.71 Q14.1
N$33
  Top 0.203: U$3.RED1 15.81,11.89 R1.2
N$34
  Top 0.203: U$3.BLU1 11.75,13.05 R2.2
N$35
  Top 0.203: R5.2 10.2,13.5 U$3.GRN1
N$36
  Top 0.203: R6.2 40.2,10.77 U$3.RED0
N$37
  Top 0.203: R24.2 32.37,9.45 33.02,9.45 33.73,10.16 34.75,10.16 35.36,10.77 35.36,11.66 U$3.BLU0
N$38
  Top 0.203: U$3.GRN0 34.2,14.53 R25.2
N$39
  Top 0.203: U$1.RED1 65.2,11.04 R26.2
N$40  (via drill 0.4)
  Top 0.203: v64.01,14.43 64.41,14.43 64.82,14.83 65.23,14.83 67.26,16.87 67.87,16.87 68.72,17.72 R27.2
  Bottom 0.203: U$1.BLU1 62.31,13.61 63.2,13.61 v64.01,14.43
N$41  (via drill 0.4)
  Top 0.203: R32.2 v62.38,15.04
  Bottom 0.203: v62.38,15.04 61.74,15.04 U$1.GRN1
N$42
  Top 0.203: U$1.RED0 90.2,10.79 R33.2
N$43
  Top 0.203: U$1.BLU0 86.2,11.46 R34.2
N$44
  Top 0.203: U$1.GRN0 84.2,11.01 R35.2
NRESET  (via drill 0.4)
  Top 0.203: X1.10 26.08,15.27 R20.2 25.03,16.05 23.57,16.05 22.55,15.04 22.55,10.57 22.96,10.16 v22.96,7.32 | U$4.3 49.46,7.19 v48.77,6.5
  Bottom 0.203: v22.96,7.32 22.35,6.71 22.35,3.86 24.59,1.63 28.04,1.63 29.01,2.59 29.52,2.59 30.28,1.83 33.53,1.83 34.75,3.05 43.89,3.05 47.35,6.5 v48.77,6.5
R1
  Top 0.203: Q3.1 20.05,13.14 23.37,16.46 24.38,16.46 25.57,17.64 R23.1
R2  (via drill 0.4)
  Top 0.203: U$4.4 49.99,8.47 v49.99,6.71 | v55.07,4.57 59.74,4.57 | 59.74,4.57 61.33,4.57 R3.2 | R17.2 59.74,5.86 59.74,4.57
  Bottom 0.203: v49.99,6.71 51.21,5.49 54.15,5.49 v55.07,4.57 56.34,3.3 JP9.1
R3
  Top 0.203: U$4.47 46.11,10.35 45.31,9.55 44.94,9.55 R4.2
R4
  Top 0.203: R12.2 79.81,15.49 74.78,20.52 53.75,20.52 53.39,20.17 51.05,20.17 50.39,19.51 50.39,17.48 50.46,17.41 U$4.32
RX  (via drill 0.4)
  Top 0.203: JP2.3 96.32,13.79 96.32,14.83 94.69,16.46 79.86,16.46 v77.22,19.1 | v74.78,21.74 74.37,21.34 57.1,21.34 56.49,21.95 55.27,21.95 54.25,20.93 53.54,20.93 53.19,20.57 50.75,20.57 v50.6,20.73 | v18.29,20.12 18.69,20.52 26.21,20.52 27.23,19.51 44.5,19.51 v44.7,19.71 | v13.21,21.74 9.35,21.74 1.57,13.97 JP6.2
  Bottom 0.203: v77.22,19.1 74.78,21.54 v74.78,21.74 | v18.29,20.12 16.66,20.12 15.04,21.74 v13.21,21.74 | v44.7,19.71 48.06,19.71 48.26,19.91 49.78,19.91 v50.6,20.73
SCL  (via drill 0.4)
  Top 0.203: U2.2 22.5,5.75 24.38,3.86 26.5,3.86 R13.2 27.23,4.48 v27.23,2.64 | U$4.15 52.65,10.85 v52.32,11.18
  Bottom 0.203: v52.32,11.18 50.8,11.18 43.48,3.86 34.34,3.86 33.12,2.64 30.63,2.64 29.87,3.4 28.65,3.4 27.89,2.64 v27.23,2.64
SDA  (via drill 0.4)
  Top 0.203: R14.2 19.62,6.4 U2.1 21.23,6.5 22.76,6.5 v23.37,5.89 | v51.71,10.46 51.71,11.48 52.02,11.79 52.63,11.79 53.07,11.35 U$4.16
  Bottom 0.203: v23.37,5.89 23.37,3.45 24.79,2.03 27.89,2.03 28.85,3 29.67,3 30.43,2.23 33.33,2.23 34.54,3.45 43.69,3.45 50.8,10.57 51.61,10.57 v51.71,10.46
SW1  (via drill 0.4)
  Top 0.203: v49.58,14.83 52.02,14.83 54,12.85 U$4.19 | v47.75,16.76 47.95,16.97 47.95,18.69 47.55,19.1 27.03,19.1 26.01,20.12 20.32,20.12 19.91,19.71 19.91,16.02 U$3.SW1-0
  Bottom 0.203: v47.75,16.76 49.58,14.94 v49.58,14.83
SW2
  Top 0.203: U$4.20 58.05,13.35 58.32,13.61 64.21,13.61 65.02,14.43 68.28,14.43 69.36,15.51 U$1.SW1-0
SW3
  Top 0.203: U$3.SW0-0 44.58,15.35 U$4.37
SW4  (via drill 0.4)
  Top 0.203: U$4.11 53.46,6.62 v53.44,6.6 | v90.83,3.45 92.86,3.45 96.11,6.71 96.11,11.38 94.41,13.08 U$1.SW0-0
  Bottom 0.203: v90.83,3.45 90.42,3.05 85.75,3.05 84.33,1.63 68.48,1.63 67.46,2.64 67.46,3.25 66.85,3.86 66.04,3.86 65.23,3.05 60.15,3.05 59.44,3.76 56.79,3.76 53.95,6.6 v53.44,6.6
SWCLK  (via drill 0.4)
  Top 0.203: v51.82,18.29 51.96,18.15 U$4.29 | v46.84,17.98 46.53,18.29 27.88,18.29 R23.2 27.27,16.83 28.04,16.05 29.46,16.05 29.67,15.85 29.67,12.19 28.94,11.46 X1.4
  Bottom 0.203: v51.82,18.29 51.51,17.98 v46.84,17.98
SWDIO
  Top 0.203: U$4.39 45.31,14.35 45.31,14.22 43.89,14.22 42.67,15.44 42.67,15.85 41.62,16.9 R22.2 40.48,17.88 29.26,17.88 28.85,17.48 28.85,16.87 29.26,16.46 29.87,16.46 30.07,16.26 30.07,10.77 29.5,10.19 X1.2
TX  (via drill 0.4)
  Top 0.203: JP2.2 95.53,16.87 80.06,16.87 78.03,18.9 78.03,19.3 v77.01,20.32 | v75.79,21.74 75.08,22.45 74.47,22.45 73.76,21.74 70,21.74 v69.7,22.05 | v60.25,24.08 59.94,24.38 50.8,24.38 v50.49,24.08 | JP6.3 6.45,11.43 8.69,13.66 9.35,13.66 9.35,15.54 11.68,17.88 18.49,17.88 v19.1,18.49
  Bottom 0.203: v77.01,20.32 75.79,21.54 v75.79,21.74 | v69.7,22.05 62.28,22.05 v60.25,24.08 | v50.49,24.08 50.19,24.38 40.03,24.38 37.8,22.15 30.63,22.15 26.67,18.19 19.41,18.19 v19.1,18.49
V+  (via drill 0.4)
  Top 0.203: U$3.GND0 37.9,12.5 36.78,11.38 36.17,11.38 35.76,10.97 35.76,8.74 33.93,6.91 29.67,6.91 29.06,6.3 29.06,2.13 v29.26,1.93
  Top 0.305: U$1.GND1 63.2,4.11 v64.87,2.44 | U$1.GND0 88.2,2.63 v89.2,1.63
  Top 0.406: U$3.GND1 13.2,12.39 12.14,11.33 7.67,11.33 7.32,10.97 7.32,9.68 U$26.3
  Top 0.61: JP6.4 4.27,8.89 C1.+ 7.24,9.02 U$26.3
  Bottom 0.203: v29.26,1.93 29.26,1.02 | v64.87,2.44 64.26,1.83 64.21,1.83
  Bottom 0.406: v89.2,1.63 89.2,2.44
  Bottom 0.61: JP2.4 98.42,6.78 94.08,2.44 89.2,2.44 86.16,2.44 84.73,1.02 65.02,1.02 64.21,1.83 63.6,2.44 61.37,2.44 59.94,1.02 55.68,1.02 54.86,1.83 54.86,3.45 53.44,4.88 46.53,4.88 44.09,2.44 35.15,2.44 33.73,1.02 29.26,1.02 14.63,1.02 13.21,2.44 5.89,2.44 1.35,6.99 JP6.4

### Text on the board
Top: VSTiBox | buttons v1.0
tNames: A | B | I | A | B | I | A | B | I | A | B | I | GND | GND | RX | TX | TX | RX | 5V | 5V | ISP | 3V3 | A | GND